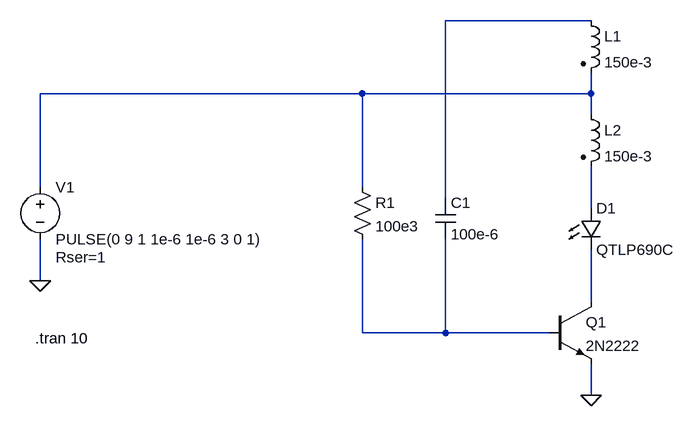
[diagram p0: schematic Oscillator.asc]
Oscillator.asc, the LTspice schematic file:
Version 4
SHEET 1 2264 1356
WIRE 800 -48 576 -48
WIRE 448 64 -48 64
WIRE 800 64 800 32
WIRE 800 64 448 64
WIRE 800 96 800 64
WIRE -48 208 -48 64
WIRE 448 208 448 64
WIRE 576 224 576 -48
WIRE 800 240 800 176
WIRE -48 352 -48 288
WIRE 800 384 800 304
WIRE 448 432 448 288
WIRE 576 432 576 288
WIRE 576 432 448 432
WIRE 736 432 576 432
WIRE 800 528 800 480
FLAG 800 528 0
FLAG -48 352 0
SYMBOL voltage -48 192 R0
WINDOW 123 0 0 Left 0
WINDOW 39 24 124 Left 2
SYMATTR SpiceLine Rser=1
SYMATTR InstName V1
SYMATTR Value PULSE(0 9 1 1e-6 1e-6 3 0 1)
SYMBOL ind2 784 -64 R0
SYMATTR InstName L1
SYMATTR Value 150e-3
SYMATTR Type ind
SYMATTR SpiceLine Rser=90
SYMBOL ind2 784 80 R0
SYMATTR InstName L2
SYMATTR Value 150e-3
SYMATTR Type ind
SYMATTR SpiceLine Rser=90
SYMBOL LED 784 240 R0
SYMATTR InstName D1
SYMATTR Value QTLP690C
SYMATTR Description Diode
SYMATTR Type diode
SYMBOL npn 736 384 R0
SYMATTR InstName Q1
SYMATTR Value 2N2222
SYMBOL res 432 192 R0
SYMATTR InstName R1
SYMATTR Value 100e3
SYMBOL cap 560 224 R0
SYMATTR InstName C1
SYMATTR Value 100e-6
SYMATTR SpiceLine V=50 Rser=10
TEXT -56 440 Left 2 !.tran 10

The netlist it stands for:
* Oscillator.asc
V1 N002 0 PULSE(0 9 1 1e-6 1e-6 3 0 1) Rser=1
L1 N001 N002 150e-3 Rser=90
L2 N002 N003 150e-3 Rser=90
D1 N003 N004 QTLP690C
Q1 N004 N005 0 0 2N2222
R1 N002 N005 100e3
C1 N001 N005 100e-6 V=50 Rser=10
.model D D
.lib standard.dio
.model NPN NPN
.model PNP PNP
.lib standard.bjt
.tran 10
.backanno
.end